# Altium schematic sheet Serial.SchDoc
size A; PageSetup: Record=PageOptions|CenterHorizontal=True|CenterVertical=True|PrintScale=1.00|XCorrection=1.00|YCorrection=1.00|PrintKind=1|BorderSize=5000000|LeftOffset=0|BottomOffset=0|Orientation=2|PaperLength=1000|PaperWidth=1000|Scale=100|PaperSource=7|PrintQuality=-4|MediaType=1|DitherType=10|PaperKind=Letter 8.5"x11" 22x28cm|PrintScaleMode=1; Organization: Underwater Robotics; Address1: c/o Student Involvement; Address2: Campus Box 7306; Address3: 2016 Cates Ave. Raleigh, NC 27695; Revision: A1; SheetNumber: 3D; SheetTotal: 4D
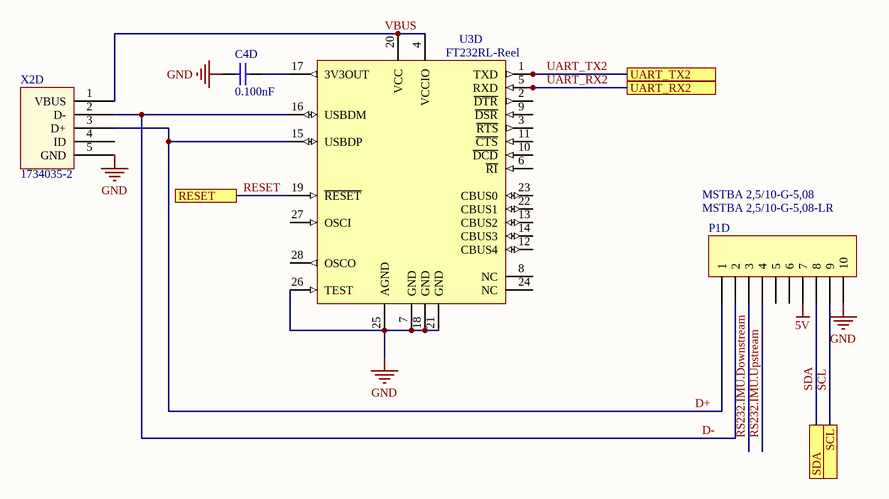
[diagram p0: Serial.SchDoc]

## Parts
C4D  value 0.100nF  [C0805]  (hidden comment: Cap)
P1D  MSTBA 2,5/10-G-5,08  Manufacturer Part Number: MSTBA 2,5/10-G-5,08-LR  [MSTBA 2,5/10-G-5,08]
U3D  FT232RL-Reel  [SSOP-28_N]
X2D  Manufacturer Part Number: 1734035-2  [UX60-MB-5ST]  (hidden comment: USB Mini Jack)

## Ports
RESET, SCL, SDA, UART_RX2, UART_TX2

## Nets
5V: P1D.7
GND: C4D.2 P1D.10 U3D.7(GND) U3D.18(GND) U3D.21(GND) U3D.25(AGND) U3D.26(TEST) X2D.5(GND)
D+: P1D.1 U3D.15(USBDP) X2D.3(D+)
D-: P1D.2 U3D.16(USBDM) X2D.2(D-)
RESET: U3D.19(~{RESET}) ; port RESET
RS232.IMU.Downstream: P1D.3
RS232.IMU.Upstream: P1D.4
SCL: P1D.9 ; port SCL
SDA: P1D.8 ; port SDA
UART_RX2: U3D.5(RXD) ; port UART_RX2
UART_TX2: U3D.1(TXD) ; port UART_TX2
VBUS: U3D.4(VCCIO) U3D.20(VCC) X2D.1(VBUS)
NetC4D_1: C4D.1 U3D.17(3V3OUT)

Not connected (* = marked no-connect by the designer): P1D 5 6; U3D 2(~{DTR}) 3(~{RTS}) 6(~{RI}) 8(NC) 9(~{DSR}) 10(~{DCD}) 11(~{CTS}) 12(CBUS4) 13(CBUS2) 14(CBUS3) 22(CBUS1) 23(CBUS0) 24(NC) 27(OSCI) 28(OSCO); X2D 4(ID)

## Notes on the sheet
- Title
- Size:
- Date:
- A
- Number:
- Time:
- Revision:
- Sheet
- of
- File:

## Library data of the parts
C4D = Cap: Unpolarized Capacitor
P1D = MSTBA 2,5/10-G-5,08: Header, 10-Pin; Manufacturer 1: PHOENIX CONTACT; Description 1: PHOENIX CONTACT - MSTBA 2,5/10-G-5,08-LR - TERMINAL BLOCK, HEADER, 10POS, TH; URL: http://www.mouser.com/ProductDetail/Phoenix-Contact/1792708/?qs=sGAEpiMZZMsDddcp1dBDJI66tvLKBAoKnRJwuCPjeJk%3d; Supplier 1: Newark; Supplier Part Number 1: 88W5041; RoHS: YES; Stock 1: 37; Pricing 1: 1=3.07, 100=2.89, 250=2.67, 500=2.55, 1000=2.27 (USD); ComponentLink1URL: http://www.farnell.com/datasheets/1702208.pdf; ComponentLink1Description: http://www.farnell.com/datasheets/1702208.pdf
U3D = FT232RL-Reel: USB UART Asynchronous Serial Data Transfer Chip, 28-pin SSOP, Tape and Reel; Manufacturer: FTDI; DatasheetVersion: ver 2.10, Mar-2012; PackageVersion: Mar-12; PackageReference: SSOP-28; PackageDescription: 28-Pin Small Outline Package 0.65 mm Pitch; PartNumber: FT232RL-Reel; ComponentLink1Description: Manufacturer URL; ComponentLink1URL: http://www.ftdichip.com/; ComponentLink2Description: Datasheet; ComponentLink2URL: http://www.ftdichip.com/Support/Documents/DataSheets/ICs/DS_FT232R.pdf
X2D = USB-MINI: USB Mini connector; Manufacturer 1: TE CONNECTIVITY; Description 1: TE CONNECTIVITY - 1734035-2 - MINI USB, 2.0 TYPE B, RECEPTACLE, SMT; Supplier Part Number 1: 16M3869; Supplier 1: Newark; RoHS: YES; Stock 1: 6729; Pricing 1: 1=1.08, 25=0.989, 50=0.989, 100=0.989, 200=0.989 (USD); ComponentLink1URL: http://www.farnell.com/datasheets/1650952.pdf; ComponentLink1Description: http://www.farnell.com/datasheets/1650952.pdf; ComponentLink2URL: http://www.farnell.com/cad/1650238.tif; ComponentLink2Description: http://www.farnell.com/cad/1650238.tif; ComponentLink3URL: http://www.farnell.com/datasheets/1665303.pdf; ComponentLink3Description: http://www.farnell.com/datasheets/1665303.pdf